# EAGLE schematic specialCharacterKeypad_v7 (EAGLE 9.7.0)
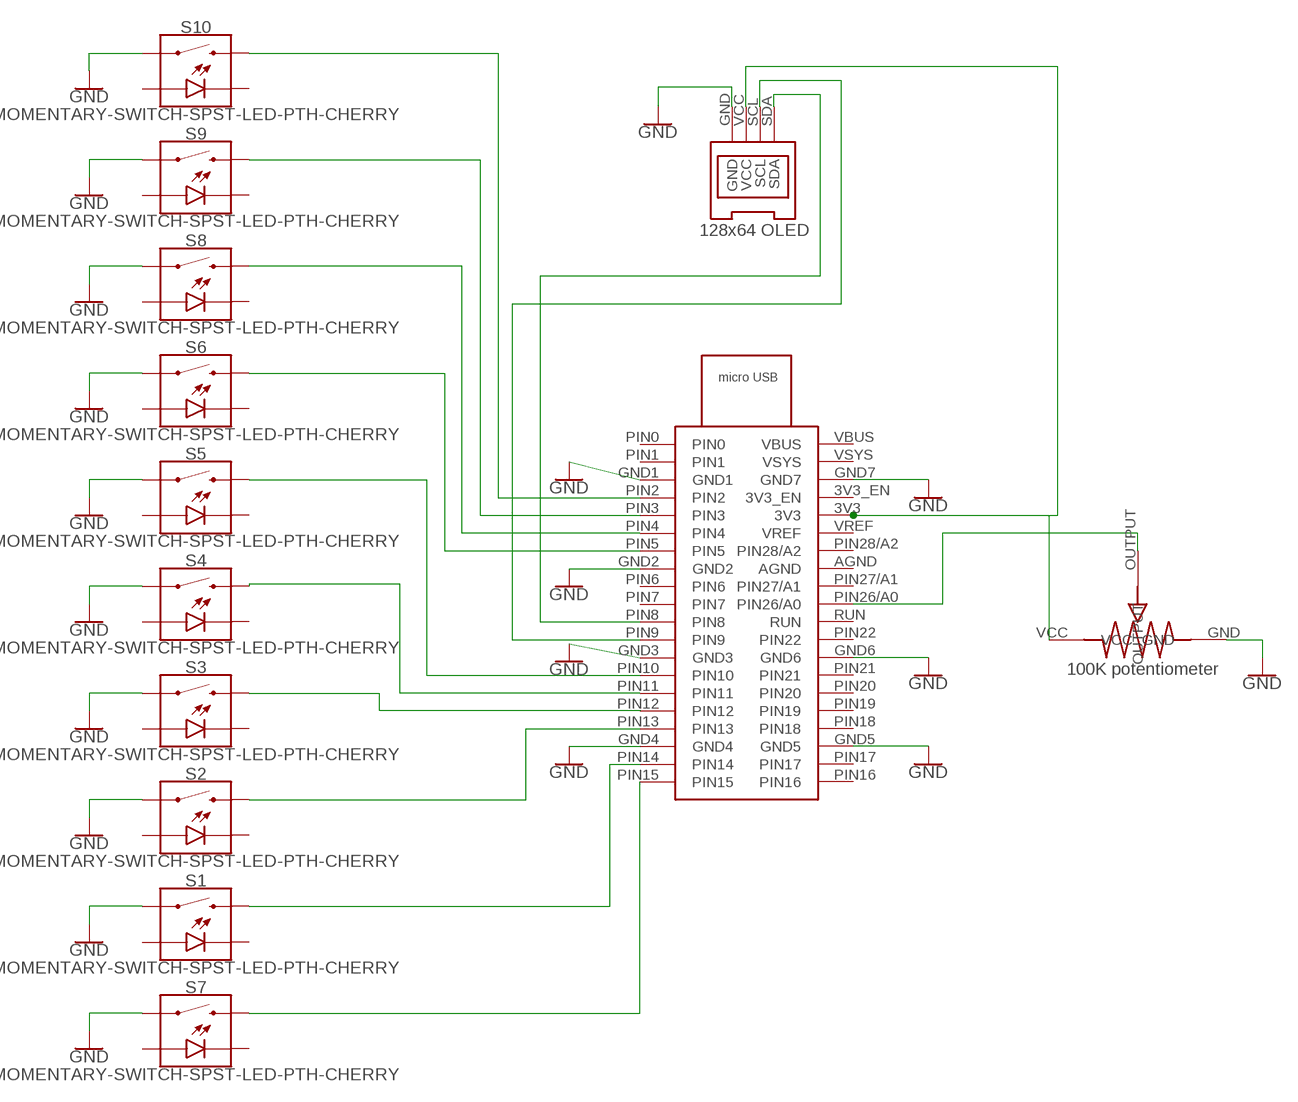
[diagram p0: schematic, sheet 1]

## Parts
S1  MOMENTARY-SWITCH-SPST-LED-PTH-CHERRY  [CHERRY-MX-LED]
S2  MOMENTARY-SWITCH-SPST-LED-PTH-CHERRY  [CHERRY-MX-LED]
S3  MOMENTARY-SWITCH-SPST-LED-PTH-CHERRY  [CHERRY-MX-LED]
S4  MOMENTARY-SWITCH-SPST-LED-PTH-CHERRY  [CHERRY-MX-LED]
S5  MOMENTARY-SWITCH-SPST-LED-PTH-CHERRY  [CHERRY-MX-LED]
S6  MOMENTARY-SWITCH-SPST-LED-PTH-CHERRY  [CHERRY-MX-LED]
S7  MOMENTARY-SWITCH-SPST-LED-PTH-CHERRY  [CHERRY-MX-LED]
S8  MOMENTARY-SWITCH-SPST-LED-PTH-CHERRY  [CHERRY-MX-LED]
S9  MOMENTARY-SWITCH-SPST-LED-PTH-CHERRY  [CHERRY-MX-LED]
S10  MOMENTARY-SWITCH-SPST-LED-PTH-CHERRY  [CHERRY-MX-LED]
U$1  KEYPAD_POT  [KEYPAD_POT]
U$2  128X64-I2C-OLED  [128X64-I2C-OLED]
U$3  RP-PICO  [RP-PICO]

## Nets
GND: S1.S1 S2.S1 S3.S1 S4.S1 S5.S1 S6.S1 S7.S1 S8.S1 S9.S1 S10.S1 U$1.GND U$2.GND U$3.GND1 U$3.GND2 U$3.GND3 U$3.GND4 U$3.GND5 U$3.GND6 U$3.GND7
N$1: U$1.VCC U$2.VCC U$3.3V3
N$2: S7.S2 U$3.PIN15
N$3: S1.S2 U$3.PIN14
N$4: S2.S2 U$3.PIN13
N$5: S3.S2 U$3.PIN12
N$6: S4.S2 U$3.PIN11
N$7: S5.S2 U$3.PIN10
N$9: U$2.SDA U$3.PIN8
N$10: U$2.SCL U$3.PIN9
N$11: S6.S2 U$3.PIN5
N$12: S10.S2 U$3.PIN2
N$13: S9.S2 U$3.PIN3
N$14: S8.S2 U$3.PIN4
N$15: U$1.OUTPUT U$3.PIN26/A0
Unconnected: S1.A S1.K(C) S2.A S2.K(C) S3.A S3.K(C) S4.A S4.K(C) S5.A S5.K(C) S6.A S6.K(C) S7.A S7.K(C) S8.A S8.K(C) S9.A S9.K(C) S10.A S10.K(C) U$3.3V3_EN U$3.AGND U$3.PIN0 U$3.PIN1 U$3.PIN6 U$3.PIN7 U$3.PIN16 U$3.PIN17 U$3.PIN18 U$3.PIN19 U$3.PIN20 U$3.PIN21 U$3.PIN22 U$3.PIN27/A1 U$3.PIN28/A2 U$3.RUN U$3.VBUS U$3.VREF U$3.VSYS

## Library data of the parts
S1-S10 = SparkFun-Switches:MOMENTARY-SWITCH-SPST-LED: Momentary Switch (Pushbutton) - SPST - w/ LED Normally-open (NO) SPST momentary switches (buttons, pushbuttons), with a built-in LED. Variants PTH-CHERRY - Cherry MX Switch Cherry MX Keyswitches are top-of-the-line mechanical keyboard switches. They’re satisfyingly “clicky”, reliable up to tens-of-millions of key presses, and a standard in gaming and programming keyboards across the globe. This ‘blue’ version Cherry MX Switch is favored by most due to its secondary internal actuator making it less likely to “double-tap.” If you are looking for a noticeably audible and high-quality key switch, this is the perfect option for you! Cherry MX Switch <https://www.sparkfun.com/products/13834> (COM-13834) Cherry MX Switch Breakout <https://www.sparkfun.com/products/13773> (BOB-13773) PTH-12MM and PTH-12MM-KIT - 12mm Illuminated LED KIT variant is for soldering kits. There is no tStop (covering up the top side of the pads with mask). This helps the beginner see which side they should be soldering too. LED Tactile Button Breakout <https://www.sparkfun.com/products/10467> (BOB-10467) LED Tactile Button - Red <https://www.sparkfun.com/products/10442> (COM-10442) LED Tactile Button - Blue <https://www.sparkfun.com/products/10443> (COM-10443) LED Tactile Button - Green <https://www.sparkfun.com/products/10440> (COM-10440) LED Tactile Button - Orange <https://www.sparkfun.com/products/10441> (COM-10441) LED Tactile Button - White <https://www.sparkfun.com/products/10439> (COM-10439); SF_ID: COM-13834
U$1 = 100K_potentiometer:KEYPAD_POT
U$2 = 128X64-I2C-OLED:128X64-I2C-OLED
U$3 = RP_Pico-pinout-throughole:RP-PICO